# Altium schematic sheet [03] - H bridge.SchDoc
size A
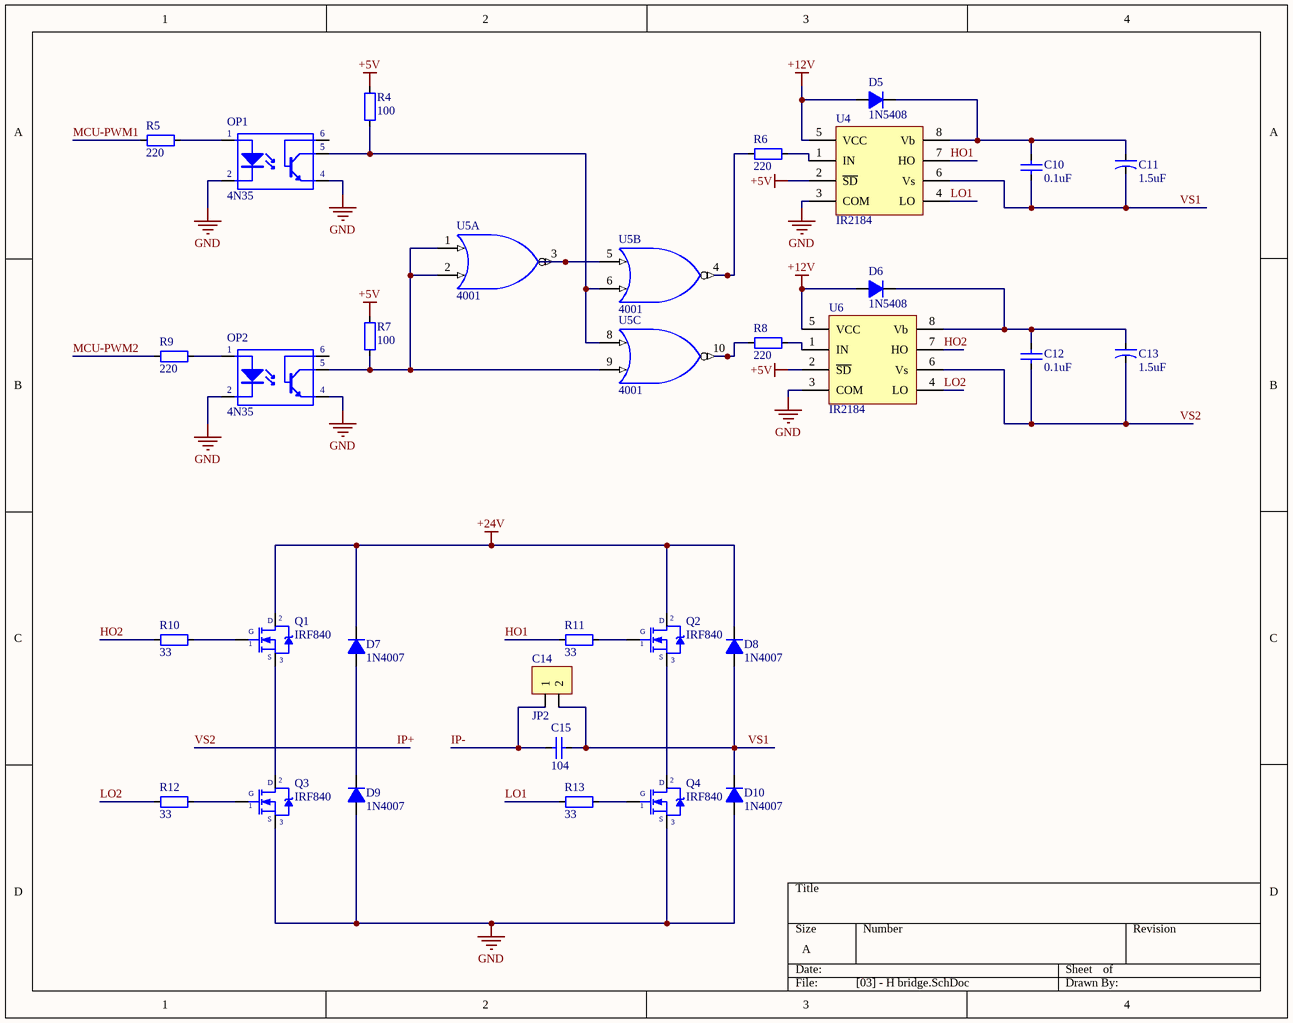
[diagram p0: [03] - H bridge.SchDoc]

## Parts
C10  0.1uF  [CAP_0402]
C11  1.5uF  [CAP-ALU-SMD-4.5x5x1.4]
C12  0.1uF  [CAP_0402]
C13  1.5uF  [CAP-ALU-SMD-4.5x5x1.4]
C14  JP2  [JP2-C1T]
C15  104  [CAP_0805]
D5  1N5408  [D5A]
D6  1N5408  [D5A]
D7  1N4007  [D1A]
D8  1N4007  [D1A]
D9  1N4007  [D1A]
D10  1N4007  [D1A]
OP1  4N35  [DIP6/W0.3]
OP2  4N35  [DIP6/W0.3]
Q1  IRF840  [QTO-220]
Q2  IRF840  [QTO-220]
Q3  IRF840  [QTO-220]
Q4  IRF840  [QTO-220]
R4  100  [RES-SMD-0805]
R5  220  [RES-SMD-0805]
R6  220  [RES-SMD-0101]
R7  100  [RES-SMD-0805]
R8  220  [RES-SMD-0101]
R9  220  [RES-SMD-0805]
R10  33  [RES-SMD-0101]
R11  33  [RES-SMD-0101]
R12  33  [RES-SMD-0101]
R13  33  [RES-SMD-0101]
U4  IR2184  [DIP8]
U5  4001  [SO14]  (parts A,B,C of 4)
U6  IR2184  [DIP8]

## Nets
+5V: R4.2 R7.2 U4.2(~{SD}) U6.2(~{SD})
+12V: D5.1(A) D6.1(A) U4.5(VCC) U6.5(VCC)
+24V: D7.2(K) D8.2(K) Q1.2(D) Q2.2(D)
GND: D9.1(A) D10.1(A) OP1.2(K) OP1.4(E) OP2.2(K) OP2.4(E) Q3.3(S) Q4.3(S) U4.3(COM) U5.7(GND) U6.3(COM)
VCC: U5.14(VCC)
HO1: R11.1 U4.7(HO)
HO2: R10.1 U6.7(HO)
IP+: C12.1 C13.2 U6.6(Vs)  [also labelled VS2]
IP-: C14.1 C15.1
LO1: R13.1 U4.4(LO)
LO2: R12.1 U6.4(LO)
MCU-PWM1: R5.1
MCU-PWM2: R9.1
VS1: C10.1 C11.2 C14.2 C15.2 D8.1(A) D10.2(K) U4.6(Vs)
NetC10_2: C10.2 C11.1 D5.2(K) U4.8(Vb)
NetC12_2: C12.2 C13.1 D6.2(K) U6.8(Vb)
NetD7_1: D7.1(A) D9.2(K)
NetOP1_1: OP1.1(A) R5.2
NetOP1_5: OP1.5(C) R4.1 U5.6 U5.8
NetOP2_1: OP2.1(A) R9.2
NetOP2_5: OP2.5(C) R7.1 U5.1 U5.2 U5.9
NetQ1_1: Q1.1(G) R10.2
NetQ1_3: Q1.3(S) Q3.2(D)
NetQ2_1: Q2.1(G) R11.2
NetQ2_3: Q2.3(S) Q4.2(D)
NetQ3_1: Q3.1(G) R12.2
NetQ4_1: Q4.1(G) R13.2
NetR6_1: R6.1 U5.4
NetR6_2: R6.2 U4.1(IN)
NetR8_1: R8.1 U5.10
NetR8_2: R8.2 U6.1(IN)
NetU5_3: U5.3 U5.5

Not connected (* = marked no-connect by the designer): OP1 6(C); OP2 6(C)

## Library data of the parts
C10 C12 C15 = CapSMD: Capacitor; Value: 33p; Published: 8-Jun-2000; LatestRevisionDate: 17-Jul-2002; LatestRevisionNote: Re-released for DXP Platform.; PackageReference: RAD-0.3; Publisher: Altium Limited
C11 C13 = CAP-ALU-SMD: Polarized Capacitor (Axial); Published: 8-Jun-2000; LatestRevisionDate: 17-Jul-2002; LatestRevisionNote: Re-released for DXP Platform.; PackageReference: POLAR0.8; Publisher: Altium Limited
C14 = JP2: WR-PHD 2.54 mm Angled Socket Header; Manufacturer: W¨¹rth Elektronik eiSos GmbH; partNo: 613002143121; ComponentLink1 Description: Manufacturer; ComponentLink2 Description: Datasheet; NoPins: 02; Created Date: 29 March 2013; ComponentLink1URL: http://www.we-online.com; ComponentLink2URL: http://katalog.we-online.de/em/datasheet/6130xx143121.pdf; Created by: Karrer Zheng
D5 D6 = D5A: Diode 5A; Value: 1N5408
D7-D10 = D1A: Diode 1A; Value: 1N4007
OP1 OP2 = 4N35: Opto; Value: 4N35
Q1-Q4 = IRF840: MOSFET N - CHANNEL 500V - 0.75 - 8A - TO-220; Value: IRF840
R4-R13 = Resistor - SMD: Resistor; Manufacturer: Generic Components; Class: Passive; Published: 08/06/2000; Publisher: Altium Hobart Technology Centre
U4 U6 = IR2184: Half-Bridge Driver
U5 = 4001: Quad 2-INPUT NOR GATE